# EAGLE design ACME (EAGLE 9.2.1)
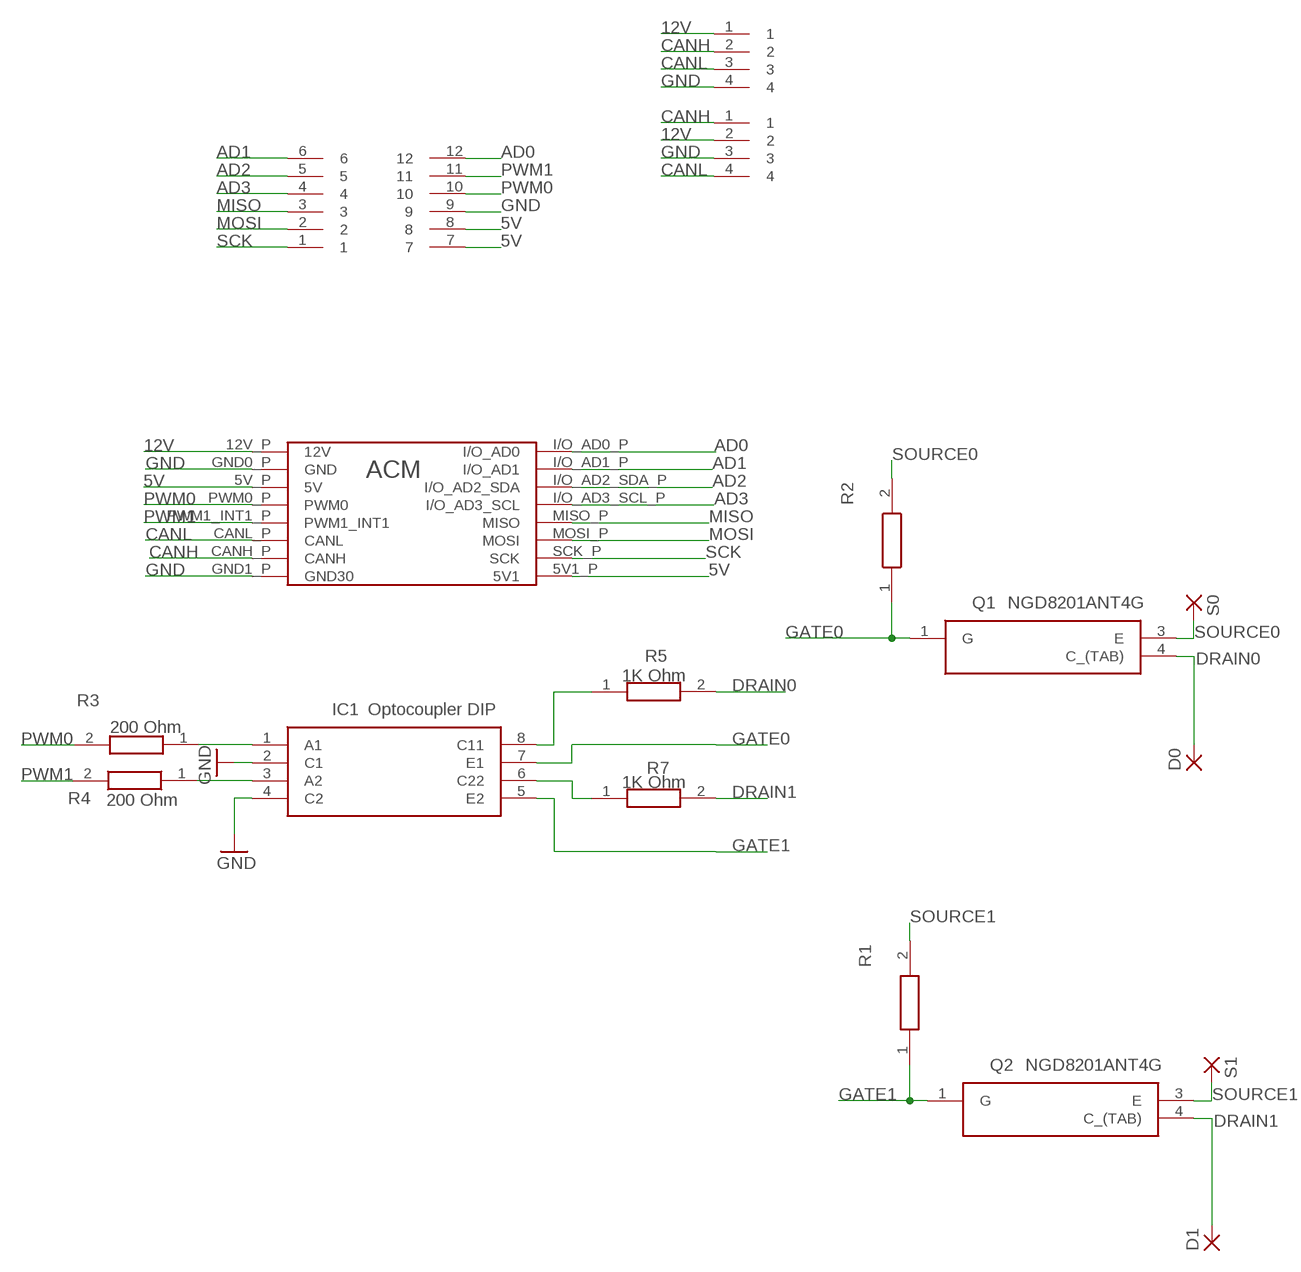
[diagram p0: schematic, sheet 1]

## Parts
D0  WIREPADSMD5-2,5  [5-2,5]
D1  WIREPADSMD5-2,5  [5-2,5]
IC1  Optocoupler DIP  TLP350(F)  [DIP762W60P254L966H485Q8N]
Q1  NGD8201ANT4G  [TO229P990X238-4N]
Q2  NGD8201ANT4G  [TO229P990X238-4N]
R1  ERA-3AEB2262V  [RESC1608X55N]
R2  ERA-3AEB2262V  [RESC1608X55N]
R3  200 Ohm  ERA-3AEB2262V  [RESC1608X55N]
R4  200 Ohm  ERA-3AEB2262V  [RESC1608X55N]
R5  1K Ohm  ERA-3AEB2262V  [RESC1608X55N]
R7  1K Ohm  ERA-3AEB2262V  [RESC1608X55N]
S0  WIREPADSMD5-2,5  [5-2,5]
S1  WIREPADSMD5-2,5  [5-2,5]
U$1  ACM_CASTELLATED  [ACM_CAS_FP]
U$2  16P_CONNECTOR  [16P_CONNECTOR_FP]
U$3  16P_CONNECTOR  [16P_CONNECTOR_FP]
U$4  16P_CONNECTOR  [16P_CONNECTOR_FP]

## Nets
5V: U$1.5V1_P(5V1) U$1.5V_P(5V) U$2.7 U$2.8
12V: U$1.12V_P(12V) U$3.1 U$4.2
AD0: U$1.I/O_AD0_P(I/O_AD0) U$2.12
AD1: U$1.I/O_AD1_P(I/O_AD1) U$2.6
AD2: U$1.I/O_AD2_SDA_P(I/O_AD2_SDA) U$2.5
AD3: U$1.I/O_AD3_SCL_P(I/O_AD3_SCL) U$2.4
CANH: U$1.CANH_P(CANH) U$3.2 U$4.1
CANL: U$1.CANL_P(CANL) U$3.3 U$4.4
DRAIN0: D0.1(P) Q1.4(C_(TAB)) R5.2
DRAIN1: D1.1(P) Q2.4(C_(TAB)) R7.2
GATE0: IC1.7(E1) Q1.1(G) R2.1
GATE1: IC1.5(E2) Q2.1(G) R1.1
GND: IC1.2(C1) IC1.4(C2) U$1.GND0_P(GND) U$1.GND1_P(GND30) U$2.9 U$3.4 U$4.3
MISO: U$1.MISO_P(MISO) U$2.3
MOSI: U$1.MOSI_P(MOSI) U$2.2
N$2: IC1.1(A1) R3.1
N$6: IC1.3(A2) R4.1
N$7: IC1.8(C11) R5.1
N$13: IC1.6(C22) R7.1
PWM0: R3.2 U$1.PWM0_P(PWM0) U$2.10
PWM1: R4.2 U$1.PWM1_INT1_P(PWM1_INT1) U$2.11
SCK: U$1.SCK_P(SCK) U$2.1
SOURCE0: Q1.3(E) R2.2 S0.1(P)
SOURCE1: Q2.3(E) R1.2 S1.1(P)

## Library data of the parts
D0 D1 S0 S1 = wirepad:WIREPAD: Wire PAD connect wire on PCB
IC1 = TLP350(F):TLP350(F): Toshiba TLP350(F) DC Input Optocoupler, Through Hole, 8-Pin PDIP Source: Datasheet <https://toshiba.semicon-storage.com/info/docget.jsp?did=6217&prodName=TLP350>; DESCRIPTION: Toshiba TLP350(F) DC Input Optocoupler, Through Hole, 8-Pin PDIP; HEIGHT: 4.85mm; MANUFACTURER_NAME: Toshiba; MANUFACTURER_PART_NUMBER: TLP350(F); MOUSER_PART_NUMBER: 757-TLP350(F); MOUSER_PRICE-STOCK: https://www.mouser.com/Search/Refine.aspx?Keyword=757-TLP350%28F%29; RS_PART_NUMBER: 0186022P; RS_PRICE-STOCK: http://uk.rs-online.com/web/p/products/0186022P
Q1 Q2 = NGD8201ANT4G_Mosfet:NGD8201ANT4G: Source: Datasheet <http://www.onsemi.com/pub/Collateral/NGD8201N-D.PDF>; ALLIED_NUMBER: 70341208; ALLIED_PRICE-STOCK: http://www.alliedelec.com/on-semiconductor-ngd8201ant4g/70341208/; HEIGHT: 2.38mm; MANUFACTURER_NAME: ON Semiconductor; MANUFACTURER_PART_NUMBER: NGD8201ANT4G; MOUSER_PART_NUMBER: 7470901; MOUSER_PRICE-STOCK: http://uk.rs-online.com/web/p/products/7470901; RS_PART_NUMBER: 7470901; RS_PRICE-STOCK: http://uk.rs-online.com/web/p/products/7470901
R1-R5 R7 = ERA-3AEB2262V(0603 Resistor):ERA-3AEB2262V: Thin Film Resistors - SMD 0603 22.6Kohm 0.1% 25ppm Source: Datasheet <https://industrial.panasonic.com/cdbs/www-data/pdf/RDA0000/AOA0000C237.pdf>; DESCRIPTION: Thin Film Resistors - SMD 0603 22.6Kohm 0.1% 25ppm; HEIGHT: 0.55mm; MANUFACTURER_NAME: Panasonic; MANUFACTURER_PART_NUMBER: ERA-3AEB2262V; MOUSER_PART_NUMBER: 667-ERA-3AEB2262V; MOUSER_PRICE-STOCK: https://www.mouser.com/Search/Refine.aspx?Keyword=667-ERA-3AEB2262V
U$1 = ACM_Pindown:ACM_CASTELLATED
U$2 = 12P_Connector holes:16P_CONNECTOR
U$3 U$4 = 4P_Connector holes:16P_CONNECTOR

## Board
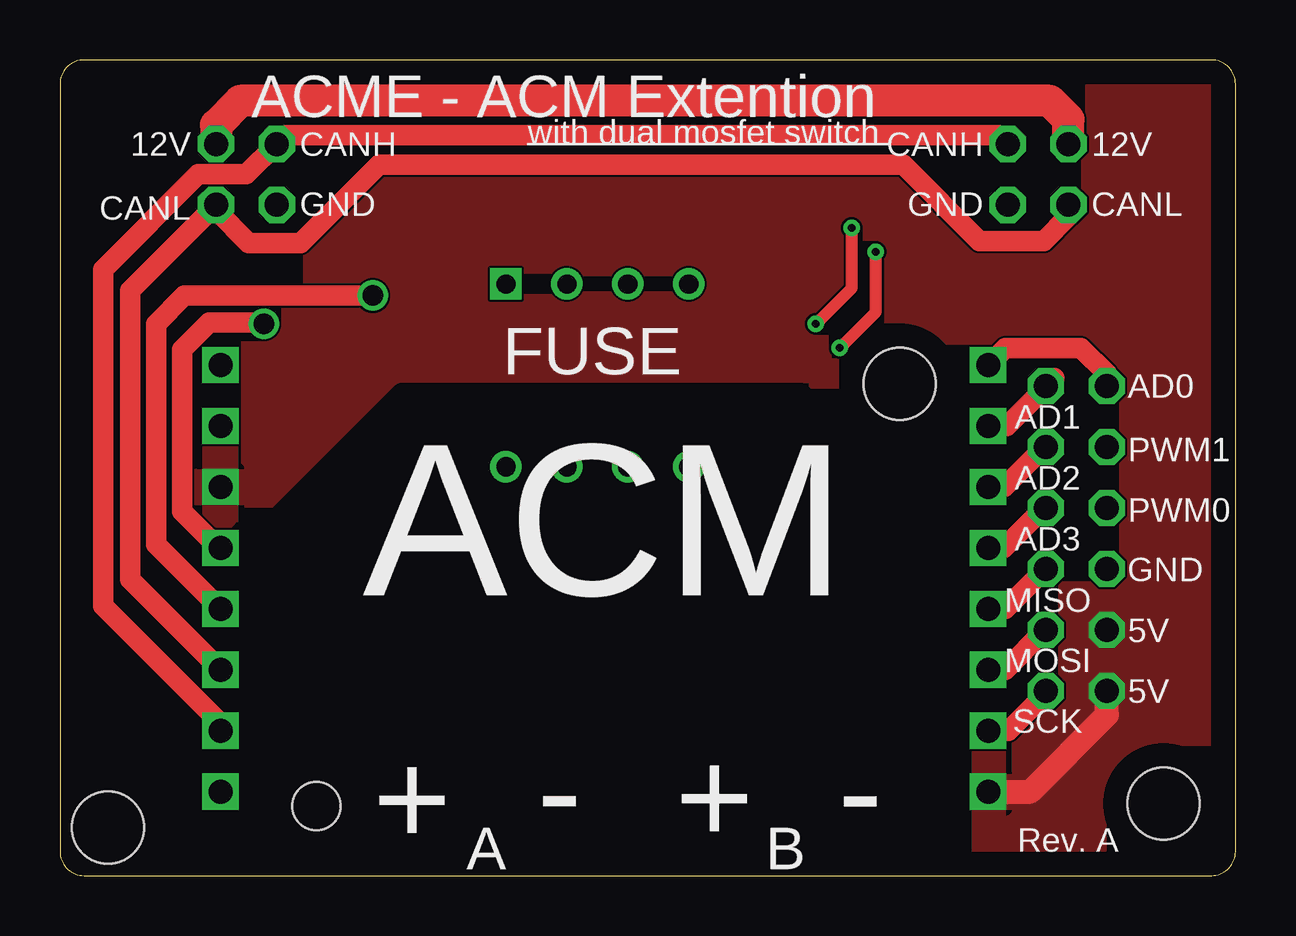
[diagram p1: board, top side]
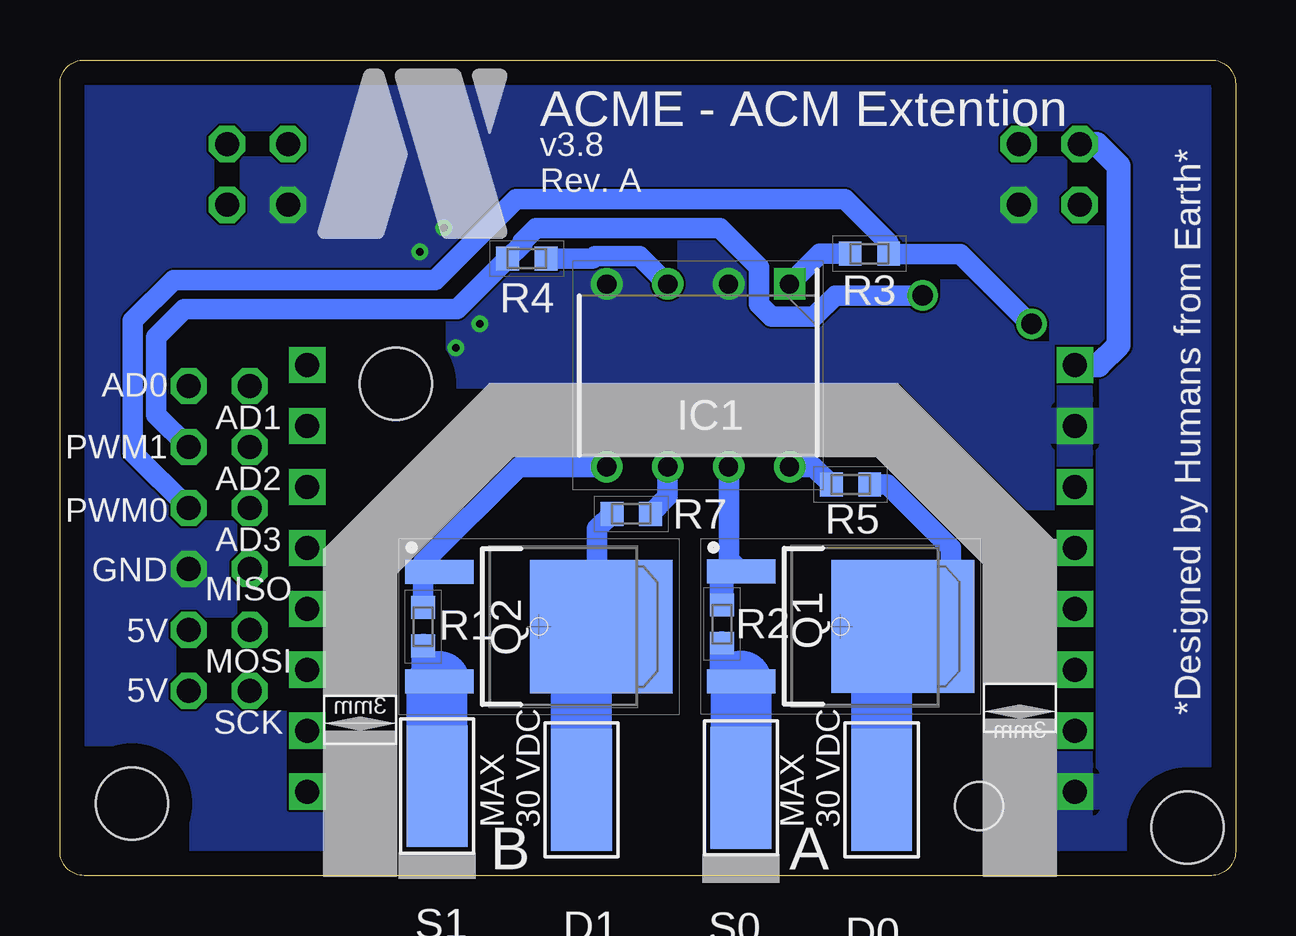
[diagram p2: board, bottom side, seen from below]

Size 49 x 34 mm. Coordinates in mm from the lower left corner, seen from the top.
Outline: 1,0 48,0 arc90 49,1 49,33 arc90 48,34 1,34 arc90 0,33 0,1 arc90 1,0
Copper layers (1*16): Top 0.035mm / dielectric 1.53mm / Bottom 0.035mm
Design rules "default *": minimum track width 3.5mil, minimum drill 0.2mm, track to track 3.5mil, track to pad 3.5mil, pad to pad 5mil, via to via 5mil, smd to smd 3.5mil, copper to edge 40mil, drill to drill 6mil, minimum pad ring 10mil, minimum via ring 8mil, stop-mask expansion 4mil, vias tented up to drill 0mil, thermal gap 10mil
Holes 2 mm at 10.69,2.89
Holes 3 mm at 46,3 35,20.5 2,2

### Footprints (pad centres in the part's own frame; a part is rotated, then mirrored left to right if it is on the bottom)
5-2,5 = smd 2.54 x 5.08: 1 0,0
DIP762W60P254L966H485Q8N = drill 0.8 pad 1.2 square: 1 -3.81,3.81 | drill 0.8 pad 1.2: 2 -3.81,1.27; 3 -3.81,-1.27; 4 -3.81,-3.81; 5 3.81,-3.81; 6 3.81,-1.27; 7 3.81,1.27; 8 3.81,3.81
TO229P990X238-4N = smd 2.85 x 1: 1 -4.15,2.29; 3 -4.15,-2.29 | smd 5.95 x 5.55: 4 2.6,0
RESC1608X55N = smd 0.95 x 1: 1 -0.8,0; 2 0.8,0
ACM_CAS_FP = drill 1 square: 5V1_P 32,3.61; 5V_P 0,16.31; 12V_P 0,21.39; CANH_P 0,6.15; CANL_P 0,8.69; GND0_P 0,18.85; GND1_P 0,3.61; I/O_AD0_P 32,21.39; I/O_AD1_P 32,18.85; I/O_AD2_SDA_P 32,16.31; I/O_AD3_SCL_P 32,13.77; MISO_P 32,11.23; MOSI_P 32,8.69; PWM0_P 0,13.77; PWM1_INT1_P 0,11.23; SCK_P 32,6.15
16P_CONNECTOR_FP = drill 1 octagon: 1 0,0; 2 2.54,0; 3 5.08,0; 4 7.62,0; 5 10.16,0; 6 12.7,0; 7 0,-2.54; 8 2.54,-2.54; 9 5.08,-2.54; 10 7.62,-2.54; 11 10.16,-2.54; 12 12.7,-2.54
16P_CONNECTOR_FP' = drill 1 octagon: 1 0,0; 2 2.54,0; 3 0,-2.54; 4 2.54,-2.54

### Placement (x,y rotation side)
D0  14.75,3.57 180 bottom
D1  27.26,3.58 180 bottom
IC1  22.4,20.85 270 bottom
Q1  16.46,10.39 0 bottom
Q2  29.04,10.38 0 bottom
R1  33.86,10.38 270 bottom
R2  21.41,10.49 270 bottom
R3  15.26,25.92 0 bottom
R4  29.54,25.72 180 bottom
R5  16.05,16.3 0 bottom
R7  25.19,15.08 180 bottom
S0  20.62,3.65 0 bottom
S1  33.28,3.73 180 bottom
U$1  6.69,-0.11 0 top
U$2  41.1,7.7 90 top
U$3  16P_CONNECTOR  [16P_CONNECTOR_FP']  6.5,30.5 0 top
U$4  16P_CONNECTOR  [16P_CONNECTOR_FP']  39.5,30.5 0 top

### Tracks (layer width: path | path; a pad name or v marks a point on that pad's centre or on a via)
5V
  Top 1: U$1.5V1_P 40.44,3.5 43.64,6.7 U$2.7
  pour Top: 61,42 61,2 51,-8 -4,-8 -8,-4 -8,32 2,42
  cutout Top: 37.76,-1.26 37.76,13.49 30.97,20.28 14.16,20.28 7.7,13.82 7.7,-1.26
12V
  Top 1.33: U$3.1 6.5,31.29 7.51,32.3 41.27,32.3 42.04,31.52 U$4.2
  Bottom 1: U$1.12V_P 5.71,21.28 4.87,22.12 4.87,29.58 5.79,30.5 U$3.1
AD0
  Top 0.85: U$1.I/O_AD0_P 39.41,22 42.56,22 43.64,20.92 U$2.12
AD1
  Top 0.85: U$1.I/O_AD1_P 39.46,18.74 41.44,20.72 41.44,20.74 U$2.6
AD2
  Top 0.85: U$1.I/O_AD2_SDA_P 39.37,16.2 41.03,17.86 U$2.5
AD3
  Top 0.85: U$1.I/O_AD3_SCL_P 39.34,13.66 41,15.32 U$2.4
CANH
  Top 0.85: U$4.1 39.14,30.86 9.4,30.86 U$3.2 7.77,29.23 5.77,29.23 1.8,25.27 1.8,11.23 6.69,6.34 U$1.CANH_P
CANL
  Top 0.85: U$1.CANL_P 2.92,12.35 2.92,24.38 U$3.3 6.5,27.73 7.87,26.36 10.04,26.36 13.31,29.63 35.15,29.63 38.33,26.45 41,26.45 42.04,27.49 U$4.4
DRAIN0
  Bottom 0.85: R5.2 14.51,16.3 11.86,13.65 11.86,12.39 Q1.4
  Bottom 2.54: D0.1 14.75,9.5 Q1.4
DRAIN1
  Bottom 0.85: R7.2 26.61,14.46 26.61,10.55 Q2.4
  Bottom 2.54: D1.1 27.26,9.55 Q2.4
GATE0
  Bottom 0.85: IC1.7 21.11,17.02 21.11,13.18 Q1.1
  Bottom 1: R2.1 21.41,12.68 Q1.1
GATE1
  Bottom 0.85: R1.1 33.86,13.05 29.87,17.04 IC1.5
GND  (via drill 0.3)
  Top 0.5: v32.5,22 34,23.5 v34,26 | v31.5,23 33,24.5 v33,27
  pour Bottom: 55,40 55,-11 -11,-11 -11,40
  cutout Bottom: 36.5,-3 37.72,-1.78 37.72,13.53 30.98,20.27 14.11,20.27 7.7,13.86 7.7,-2.11 8.59,-3
MISO
  Top 0.85: U$1.MISO_P 39.41,11.12 41.07,12.78 U$2.3
MOSI
  Top 0.85: U$1.MOSI_P 39.4,8.58 41.06,10.24 U$2.2
N$2
  Bottom 0.85: R3.1 17.33,25.92 IC1.1
N$6
  Bottom 0.85: R4.1 26.8,25.72 26.69,25.83 24.84,25.83 IC1.3
N$7
  Bottom 0.85: IC1.8 17.59,17.04 R5.1
N$13
  Bottom 0.85: IC1.6 23.67,15.8 R7.1
PWM0  (via drill 0.85)
  Top 0.85: U$1.PWM0_P 6.62,13.66 5.09,15.18 5.09,21.92 6.22,23.05 8.45,23.05 v8.5,23
  Bottom 0.85: U$2.10 45.96,17.64 45.96,23.14 44.27,24.83 33.37,24.83 30,28.2 16.28,28.2 14.46,26.38 R3.2 11.47,25.91 8.56,23 v8.5,23
PWM1  (via drill 0.85)
  Top 0.85: U$1.PWM1_INT1_P 4,13.81 4,23 5.18,24.18 v13.04,24.18
  Bottom 0.85: U$2.11 44.99,19.21 44.99,22.45 43.82,23.62 32.44,23.62 R4.2 29.73,26.33 29.73,26.43 29.16,27 21.5,27 19.86,25.36 19.86,23.81 19.34,23.29 17.57,23.29 16.68,24.18 v13.04,24.18
SCK
  Top 0.85: U$2.1 41.1,7.6 39.54,6.04 U$1.SCK_P
SOURCE0
  Bottom 0.85: S0.1 20.61,3.61
  Bottom 1: Q1.3 21.41,8.1 R2.2
  Bottom 2.54: Q1.3 20.61,3.61
SOURCE1
  Bottom 1: R1.2 33.86,8.09 Q2.3
  Bottom 2.54: S1.1 33.28,8 Q2.3

### Text on the board
tNames: ACME - ACM Extention | 12V | with dual mosfet switch | CANH | CANH | 12V | CANL | GND | GND | CANL | AD1 | AD0 | PWM1 | AD2 | AD3 | PWM0 | GND | MISO | 5V | MOSI | 5V | SCK | - | - | + | + | A | B | Rev. A
bNames: ACME - ACM Extention | v3.8 | Rev. A | AD1 | AD0 | *Designed by Humans from Earth* | PWM1 | AD2 | AD3 | PWM0 | GND | MISO | 5V | MOSI | 5V | SCK | MAX / 30 VDC | MAX / 30 VDC | A | B